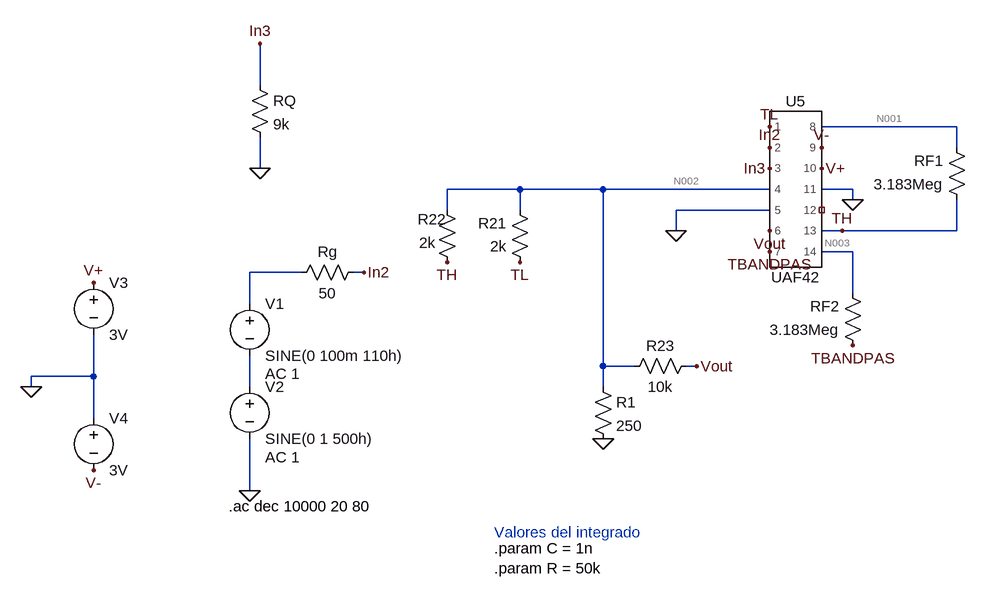
[diagram p0: schematic Filtro_Notch_UAF42.asc]
Filtro_Notch_UAF42.asc, the LTspice schematic file:
Version 4
SHEET 1 1324 1236
WIRE -720 -112 -720 -176
WIRE 352 -48 144 -48
WIRE 352 -16 352 -48
WIRE -720 16 -720 -32
WIRE -320 48 -432 48
WIRE -192 48 -320 48
WIRE 64 48 -192 48
WIRE 192 48 144 48
WIRE 192 64 192 48
WIRE -432 80 -432 48
WIRE -320 80 -320 48
WIRE 64 80 -80 80
WIRE -80 112 -80 80
WIRE 176 112 144 112
WIRE 352 112 352 64
WIRE 352 112 176 112
WIRE 192 144 144 144
WIRE -656 176 -736 176
WIRE -560 176 -576 176
WIRE 192 208 192 144
WIRE -736 224 -736 176
WIRE -192 320 -192 48
WIRE -144 320 -192 320
WIRE -48 320 -64 320
WIRE -976 336 -976 272
WIRE -976 336 -1072 336
WIRE -1072 352 -1072 336
WIRE -736 352 -736 304
WIRE -192 352 -192 320
WIRE -976 400 -976 336
WIRE -736 512 -736 432
FLAG -720 -176 In3
FLAG -560 176 In2
FLAG -720 16 0
FLAG -736 512 0
FLAG 64 16 In3
FLAG 64 -16 In2
FLAG 64 -48 TL
FLAG 176 112 TH
FLAG 64 144 TBANDPAS
FLAG 192 64 0
FLAG 144 16 V+
FLAG 144 -16 V-
FLAG -48 320 Vout
FLAG 64 112 Vout
FLAG -80 112 0
FLAG -1072 352 0
FLAG -976 192 V+
FLAG -976 480 V-
FLAG -320 160 TL
FLAG 192 288 TBANDPAS
FLAG -432 160 TH
FLAG -192 432 0
SYMBOL res -736 -128 R0
SYMATTR InstName RQ
SYMATTR Value 9k
SYMBOL voltage -736 208 R0
WINDOW 123 24 124 Left 2
WINDOW 39 0 0 Left 0
SYMATTR Value2 AC 1
SYMATTR InstName V1
SYMATTR Value SINE(0 100m 110h)
SYMBOL voltage -736 336 R0
WINDOW 123 24 124 Left 2
WINDOW 39 0 0 Left 0
SYMATTR Value2 AC 1
SYMATTR InstName V2
SYMATTR Value SINE(0 1 500h)
SYMBOL res -560 160 R90
WINDOW 0 0 56 VBottom 2
WINDOW 3 32 56 VTop 2
SYMATTR InstName Rg
SYMATTR Value 50
SYMBOL UAF42 96 48 R0
SYMATTR InstName U5
SYMBOL res 368 80 R180
WINDOW 0 36 76 Left 2
WINDOW 3 36 40 Left 2
SYMATTR InstName RF1
SYMATTR Value 3.183Meg
SYMBOL res 208 304 R180
WINDOW 0 36 76 Left 2
WINDOW 3 36 40 Left 2
SYMATTR InstName RF2
SYMATTR Value 3.183Meg
SYMBOL res -48 304 R90
WINDOW 0 0 56 VBottom 2
WINDOW 3 32 56 VTop 2
SYMATTR InstName R23
SYMATTR Value 10k
SYMBOL voltage -976 176 R0
SYMATTR InstName V3
SYMATTR Value 3V
SYMBOL voltage -976 384 R0
SYMATTR InstName V4
SYMATTR Value 3V
SYMBOL res -304 176 R180
WINDOW 0 36 76 Left 2
WINDOW 3 36 40 Left 2
SYMATTR InstName R21
SYMATTR Value 2k
SYMBOL res -448 64 R0
WINDOW 0 -29 30 Left 2
WINDOW 3 -27 66 Left 2
SYMATTR InstName R22
SYMATTR Value 2k
SYMBOL res -208 336 R0
SYMATTR InstName R1
SYMATTR Value 250
TEXT -768 536 Left 2 !.ac dec 10000 20 80
TEXT -360 576 Left 2 ;Valores del integrado
TEXT -360 600 Left 2 !.param C = 1n\n.param R = 50k

The netlist it stands for:
* Filtro_Notch_UAF42.asc
RQ In3 0 9k
V1 N004 N005 SINE(0 100m 110h) AC 1
V2 N005 0 SINE(0 1 500h) AC 1
Rg In2 N004 50
XU5 TL In2 In3 N002 0 Vout TBANDPAS N001 V- V+ 0 NC_01 TH N003 UAF42  ; pins 1 2 3 4 5 6 7 8 9 10 11 12 13 14
RF1 TH N001 3.183Meg
RF2 TBANDPAS N003 3.183Meg
R23 Vout N002 10k
V3 V+ 0 3V
V4 0 V- 3V
R21 TL N002 2k
R22 N002 TH 2k
R1 N002 0 250
.ac dec 10000 20 80
* Valores del integrado
.param C = 1n
.param R = 50k
.lib "C:\Users\marti\AppData\Local\LTspice\lib\sub\UAF42.lib"
.backanno
.end

* Results of the author's LTspice run, read from the files saved beside the schematic
* Operating Point, zero values left out:
*   V(in3) = 3.52 µV
*   V(in2) = 3.517 nV
*   V(th) = 26.81 µV
*   V(v-) = -3 V
*   V(v+) = 3 V
*   V(tbandpas) = 26.95 µV
*   V(n001) = 4.528 µV
*   V(tl) = -10.36 µV
*   V(n003) = 4.664 µV
*   V(vout) = -95.05 mV
*   V(n002) = -1.862 mV
*   I(Rq) = 391.2 pA
*   I(Rg) = 70.34 pA
*   I(Rf1) = 7 pA
*   I(Rf2) = 7 pA
*   I(R23) = -9.319 µA
*   I(R21) = 925.9 nA
*   I(R22) = -944.5 nA
*   I(R1) = -7.448 µA
*   I(V1) = 70.34 pA
*   I(V2) = 70.34 pA
*   I(V3) = -5.201 mA
*   I(V4) = -5.21 mA
*   Ix(u5:1) = -925.9 nA
*   Ix(u5:2) = -70.34 pA
*   Ix(u5:3) = -391.2 pA
*   Ix(u5:4) = 7.002 pA
*   Ix(u5:5) = 7 pA
*   Ix(u5:6) = 9.319 µA
*   Ix(u5:7) = -7 pA
*   Ix(u5:8) = 7 pA
*   Ix(u5:9) = -5.21 mA
*   Ix(u5:10) = 5.201 mA
*   Ix(u5:11) = 14 pA
*   Ix(u5:13) = -944.5 nA
*   Ix(u5:14) = 7 pA
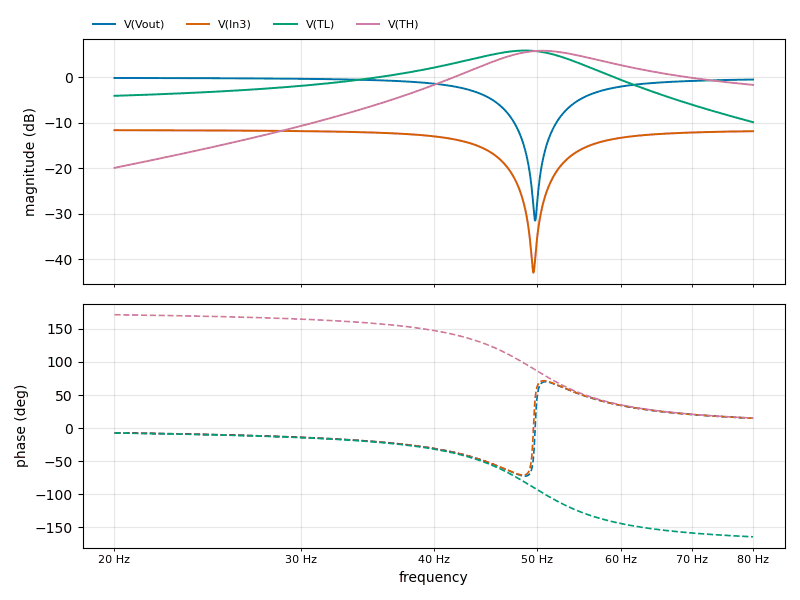
[diagram p1: AC Analysis of Filtro_Notch_UAF42.asc, plotted from the saved traces]
* AC Analysis, 1 run:
*   V(Vout): -0.14 dB at 20 Hz, -0.49 dB at 80 Hz, peak -0.14 dB at 20 Hz, 3 dB below the peak at 43.73 Hz
*   V(In3): -11.64 dB at 20 Hz, -11.86 dB at 80 Hz, peak -11.64 dB at 20 Hz, 3 dB below the peak at 43.47 Hz
*   V(TL): -4.08 dB at 20 Hz, -9.87 dB at 80 Hz, peak 5.89 dB at 48.77 Hz, 3 dB below the peak at 41.42 Hz and 55.15 Hz
*   V(TH): -19.93 dB at 20 Hz, -1.67 dB at 80 Hz, peak 5.83 dB at 50.62 Hz, 3 dB below the peak at 44.77 Hz and 59.61 Hz